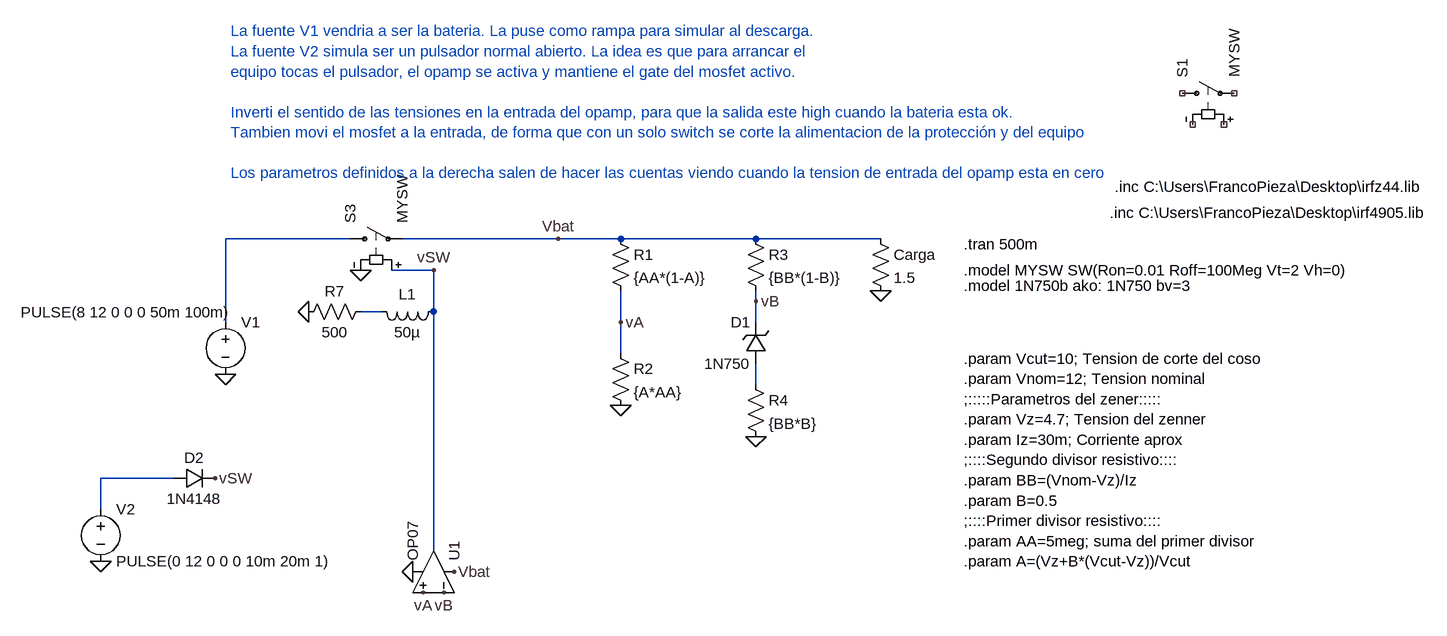
[diagram p0: schematic Limitador 10V con rele.asc]
Limitador 10V con rele.asc, the LTspice schematic file:
Version 4
SHEET 1 1956 684
WIRE -192 48 -384 48
WIRE 128 48 -112 48
WIRE 224 48 128 48
WIRE 432 48 224 48
WIRE 624 48 432 48
WIRE -64 96 -128 96
WIRE 432 144 432 128
WIRE -144 160 -176 160
WIRE -64 160 -64 96
WIRE -384 176 -384 48
WIRE 224 176 224 128
WIRE 432 176 432 144
WIRE 224 224 224 176
WIRE 432 272 432 240
WIRE -464 416 -576 416
WIRE -576 464 -576 416
WIRE -64 528 -64 160
FLAG -384 256 0
FLAG 224 304 0
FLAG 432 352 0
FLAG 224 176 vA
FLAG 432 144 vB
FLAG -96 560 0
FLAG 128 48 Vbat
FLAG -32 560 Vbat
FLAG -48 592 vB
FLAG -80 592 vA
FLAG 624 128 0
FLAG -576 544 0
FLAG -400 416 vSW
FLAG -176 96 0
FLAG -256 160 0
FLAG -64 96 vSW
SYMBOL voltage -384 160 R0
WINDOW 123 0 0 Left 0
WINDOW 39 0 0 Left 0
WINDOW 3 -315 1 Left 2
SYMATTR Value PULSE(8 12 0 0 0 50m 100m)
SYMATTR InstName V1
SYMBOL res 208 32 R0
SYMATTR InstName R1
SYMATTR Value {AA*(1-A)}
SYMBOL res 208 208 R0
SYMATTR InstName R2
SYMATTR Value {A*AA}
SYMBOL res 416 32 R0
SYMATTR InstName R3
SYMATTR Value {BB*(1-B)}
SYMBOL res 416 256 R0
SYMATTR InstName R4
SYMATTR Value {BB*B}
SYMBOL Opamps\\OP07 0 560 M270
SYMATTR InstName U1
SYMBOL sw 1072 -176 R270
SYMATTR InstName S1
SYMATTR Value MYSW
SYMBOL res 608 32 R0
SYMATTR InstName Carga
SYMATTR Value 1.5
SYMBOL zener 448 240 R180
WINDOW 0 24 64 Left 2
WINDOW 3 24 0 Left 2
SYMATTR InstName D1
SYMATTR Value 1N750
SYMBOL voltage -576 448 R0
WINDOW 123 0 0 Left 0
WINDOW 39 0 0 Left 0
SYMATTR InstName V2
SYMATTR Value PULSE(0 12 0 0 0 10m 20m 1)
SYMBOL sw -208 48 R270
SYMATTR InstName S3
SYMATTR Value MYSW
SYMBOL res -160 144 R90
WINDOW 0 0 56 VBottom 2
WINDOW 3 32 56 VTop 2
SYMATTR InstName R7
SYMATTR Value 500
SYMBOL diode -464 432 R270
WINDOW 0 32 32 VTop 2
WINDOW 3 0 32 VBottom 2
SYMATTR InstName D2
SYMATTR Value 1N4148
SYMBOL ind -48 144 R90
WINDOW 0 5 56 VBottom 2
WINDOW 3 32 56 VTop 2
SYMATTR InstName L1
SYMATTR Value 50µ
TEXT 752 56 Left 2 !.tran 500m
TEXT 752 96 Left 2 !.model MYSW SW(Ron=0.01 Roff=100Meg Vt=2 Vh=0)
TEXT 752 232 Left 2 !.param Vcut=10; Tension de corte del coso\n.param Vnom=12; Tension nominal\n;:::::Parametros del zener:::::\n.param Vz=4.7; Tension del zenner\n.param Iz=30m; Corriente aprox\n;::::Segundo divisor resistivo::::\n.param BB=(Vnom-Vz)/Iz\n.param B=0.5\n;::::Primer divisor resistivo::::\n.param AA=5meg; suma del primer divisor\n.param A=(Vz+B*(Vcut-Vz))/Vcut
TEXT 752 120 Left 2 !.model 1N750b ako: 1N750 bv=3
TEXT -376 -272 Left 2 ;La fuente V1 vendria a ser la bateria. La puse como rampa para simular al descarga.\nLa fuente V2 simula ser un pulsador normal abierto. La idea es que para arrancar el\nequipo tocas el pulsador, el opamp se activa y mantiene el gate del mosfet activo.\n \nInverti el sentido de las tensiones en la entrada del opamp, para que la salida este high cuando la bateria esta ok.\nTambien movi el mosfet a la entrada, de forma que con un solo switch se corte la alimentacion de la protección y del equipo\n \nLos parametros definidos a la derecha salen de hacer las cuentas viendo cuando la tension de entrada del opamp esta en cero
TEXT 984 -32 Left 2 !.inc C:\\Users\\FrancoPieza\\Desktop\\irfz44.lib
TEXT 976 8 Left 2 !.inc C:\\Users\\FrancoPieza\\Desktop\\irf4905.lib

The netlist it stands for:
* Limitador 10V con rele.asc
V1 N001 0 PULSE(8 12 0 0 0 50m 100m)
R1 Vbat vA {AA*(1-A)}
R2 vA 0 {A*AA}
R3 Vbat vB {BB*(1-B)}
R4 N003 0 {BB*B}
XU1 vA vB Vbat 0 vSW LT1001  ; OP07, pins In+ In- V+ V- OUT
S1 NC_01 NC_02 NC_03 NC_04 MYSW
R§Carga Vbat 0 1.5
D1 N003 vB 1N750
V2 N004 0 PULSE(0 12 0 0 0 10m 20m 1)
S3 N001 Vbat vSW 0 MYSW
R7 N002 0 500
D2 N004 vSW 1N4148
L1 vSW N002 50µ
.model D D
.lib standard.dio
.tran 500m
.model MYSW SW(Ron=0.01 Roff=100Meg Vt=2 Vh=0)
.param Vcut=10; Tension de corte del coso
.param Vnom=12; Tension nominal
;:::::Parametros del zener:::::
.param Vz=4.7; Tension del zenner
.param Iz=30m; Corriente aprox
;::::Segundo divisor resistivo::::
.param BB=(Vnom-Vz)/Iz
.param B=0.5
;::::Primer divisor resistivo::::
.param AA=5meg; suma del primer divisor
.param A=(Vz+B*(Vcut-Vz))/Vcut
.model 1N750b ako: 1N750 bv=3
* La fuente V1 vendria a ser la bateria. La puse como rampa para simular al descarga.
* La fuente V2 simula ser un pulsador normal abierto. La idea es que para arrancar el
* equipo tocas el pulsador, el opamp se activa y mantiene el gate del mosfet activo.
* Inverti el sentido de las tensiones en la entrada del opamp, para que la salida este high cuando la bateria esta ok.
* Tambien movi el mosfet a la entrada, de forma que con un solo switch se corte la alimentacion de la protección y del equipo
* Los parametros definidos a la derecha salen de hacer las cuentas viendo cuando la tension de entrada del opamp esta en cero
.inc C:\Users\FrancoPieza\Desktop\irfz44.lib
.inc C:\Users\FrancoPieza\Desktop\irf4905.lib
.lib LTC.lib
.backanno
.end